# Altium schematic sheet LLA.SchDoc
size A4
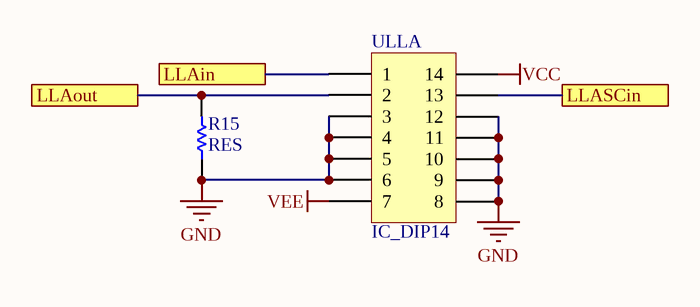
[diagram p0: LLA.SchDoc]

## Parts
R15  RES  [1206]
ULLA  IC_DIP14  [D014_M]

## Ports
LLAin, LLAout, LLASCin

## Nets
GND: R15.1 ULLA.3 ULLA.4 ULLA.5 ULLA.6 ULLA.8 ULLA.9 ULLA.10 ULLA.11 ULLA.12
VCC: ULLA.14
VEE: ULLA.7
LLAin: ULLA.1 ; port LLAin
LLAout: R15.2 ULLA.2 ; port LLAout
LLASCin: ULLA.13 ; port LLASCin